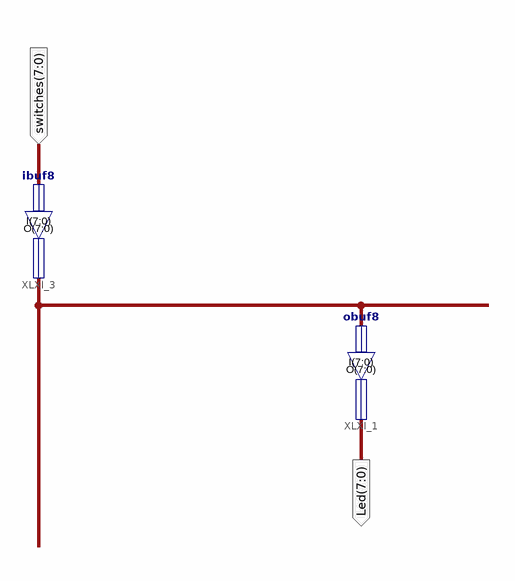
[diagram p0: schematic sheet 1]
// Xilinx ISE schematic toplevel.sch (spartan6) as structural Verilog: 2 symbols, 2 ports
module toplevel (
  input  [7:0] switches,
  output [7:0] Led
);

  wire [7:0] XLXN_14;

  ibuf8 XLXI_3 (.I(switches), .O(XLXN_14));
  obuf8 XLXI_1 (.I(XLXN_14), .O(Led));
endmodule
